# Altium schematic sheet 01-Cover.SchDoc: Cover
size A3; DocumentNumber: 1; SheetNumber: 1; SheetTotal: 5
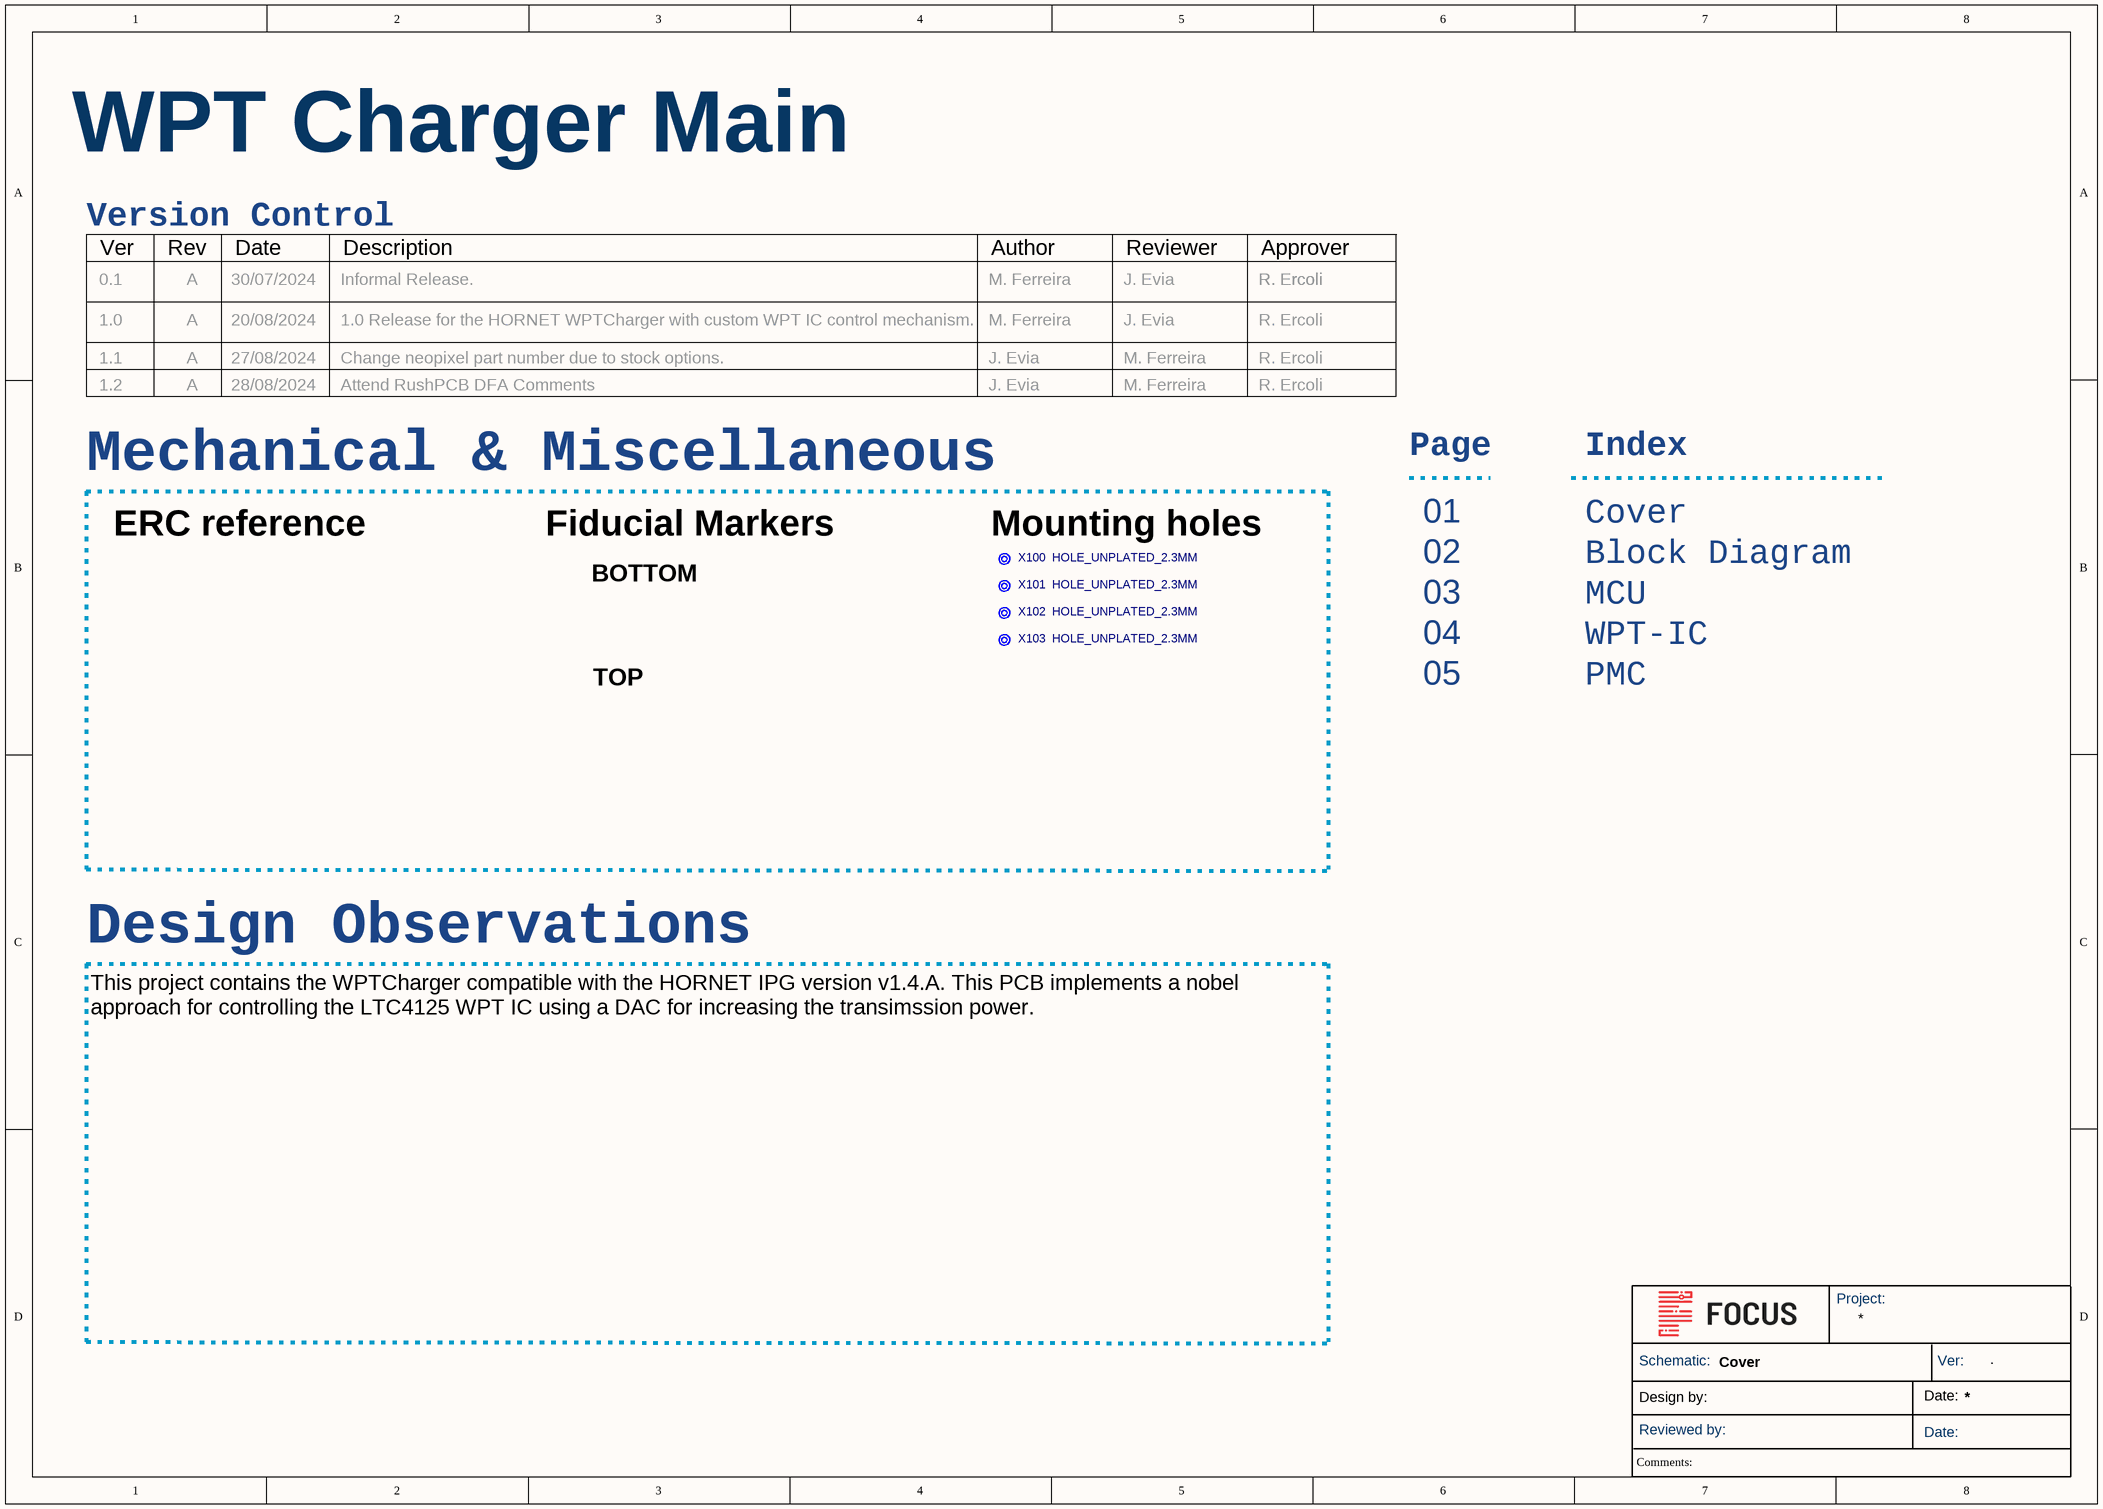
[diagram p0: 01-Cover.SchDoc]

## Parts
X100  HOLE_UNPLATED_2.3MM  [HOLE_UNPLATED_2.3MM_COUNTERSINK]  (no BOM)
X101  HOLE_UNPLATED_2.3MM  [HOLE_UNPLATED_2.3MM_COUNTERSINK]  (no BOM)
X102  HOLE_UNPLATED_2.3MM  [HOLE_UNPLATED_2.3MM_COUNTERSINK]  (no BOM)
X103  HOLE_UNPLATED_2.3MM  [HOLE_UNPLATED_2.3MM_COUNTERSINK]  (no BOM)

## Sub-sheets
U_System = 02-BlockDiagram.SchDoc: no entries

## Notes on the sheet
- WPT Charger Main
- Version Control
- 0.1
- Ver
- Rev
- A
- 30/07/2024
- Date
- Informal Release.
- Description
- M. Ferreira
- Author
- J. Evia
- Reviewer
- R. Ercoli
- Approver
- 1.0
- 1.1
- 20/08/2024
- 27/08/2024
- 1.0 Release for the HORNET WPTCharger with custom WPT IC control mechanism.
- Change neopixel part number due to stock options.
- 1.2
- 28/08/2024
- Attend RushPCB DFA Comments
- Mechanical & Miscellaneous
- Page
- Index
- ERC reference
- Fiducial Markers
- BOTTOM
- (near X100) Mounting holes
- 01
- 02
- Cover
- Block Diagram
- 03
- 04
- MCU
- WPT-IC
- TOP
- 05
- PMC
- Design Observations
- This project contains the WPTCharger compatible with the HORNET IPG version v1.4.A. This PCB implements a nobel approach for controlling the LTC4125 WPT IC using a DAC for increasing the transimssion power.
- Project:
- Schematic:
- Ver:
- .
- Design by:
- Reviewed by:
- Date:
- Comments:

## Library data of the parts
X100-X103 = HOLE_UNPLATED_2.3MM: Hole, Unplated, 2.3mm; Status: *; Review: *